# Altium project 触摸扩展板.PrjPcb
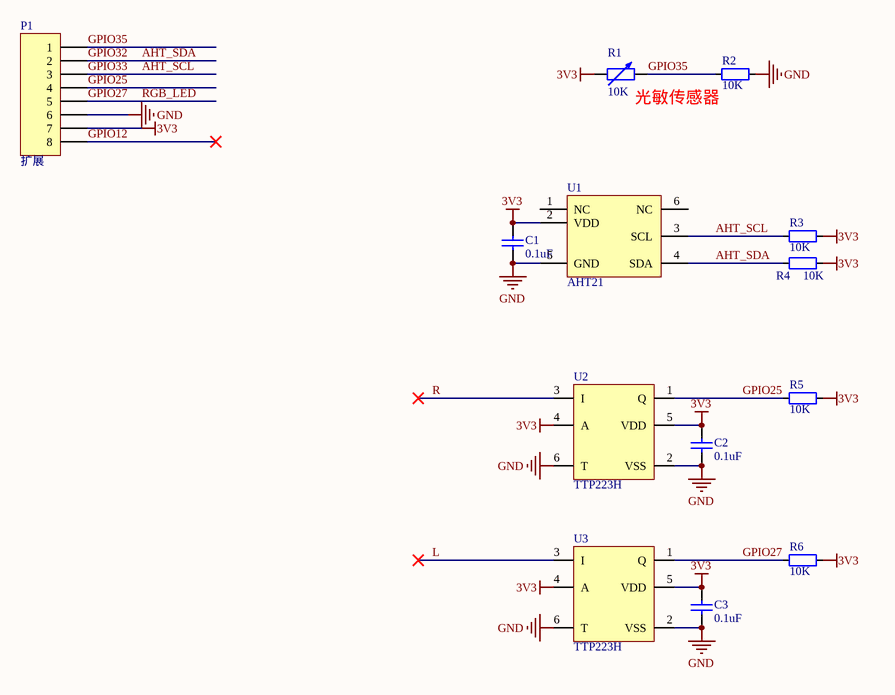
[diagram p0: 触摸扩展板.SchDoc]
1 sheet, 13 parts. Net scope: global (net labels, ports and power ports of the same name join across sheets).
Board file: 触摸扩展板.PcbDoc

## Sheet 触摸扩展板.SchDoc: 触摸扩展板
size A4; DrawnBy: Misaka; Address1: L3, 12a Rodborough Rd; Address2: Frenchs Forest; Address3: NSW; Address4: Australia 2086; Revision: Rev 1.0; SheetNumber: 1; SheetTotal: 1; PageSetup: Record=PageOptions|CenterHorizontal=True|CenterVertical=True|PrintScale=1.00|XCorrection=1.00|YCorrection=1.00|PrintKind=0|BorderSize=5000000|LeftOffset=0|BottomOffset=0|Orientation=2|PaperLength=1000|PaperWidth=1000|Scale=100|PaperSource=7|PrintQuality=-3|MediaType=1|DitherType=10|PrintScaleMode=1|PaperKind=A4|PaperIndex=9

### Parts
C1  0.1uF  [C_0603]
C2  0.1uF  [C_0603]
C3  0.1uF  [C_0603]
P1  扩展  [FPC0.5 2H-WS-8P]
R1  10K  [C_1210]
R2  10K  [R_0603]
R3  10K  [R_0603]
R4  10K  [R_0603]
R5  10K  [R_0603]
R6  10K  [R_0603]
U1  AHT21  [AHT21]
U2  TTP223H  [SOT23-6-Y]
U3  TTP223H  [SOT23-6-Y]

### Nets
3V3: C1.1 C2.1 C3.1 P1.7 R1.1 R3.1 R4.1 R5.1 R6.1 U1.2(VDD) U2.4(A) U2.5(VDD) U3.4(A) U3.5(VDD)
GND: C1.2 C2.2 C3.2 P1.6 R2.1 U1.5(GND) U2.2(VSS) U2.6(T) U3.2(VSS) U3.6(T)
AHT_SCL: P1.3 R3.2 U1.3(SCL)  [also labelled GPIO33]
AHT_SDA: P1.2 R4.2 U1.4(SDA)  [also labelled GPIO32]
GPIO12: P1.8
GPIO25: P1.4 R5.2 U2.1(Q)
GPIO27: P1.5 R6.2 U3.1(Q)  [also labelled RGB_LED]
GPIO35: P1.1 R1.2 R2.2
L: U3.3(I)
R: U2.3(I)

Not connected (* = marked no-connect by the designer): U1 1(NC) 6(NC)

### Notes on the sheet
- (near R1) 光敏传感器
- 电路名称:
- 编号:
- Sch drawn by Misaka
- 版本:
- 作者:
- 时间:

### Library data of the parts
C1-C3 = Cap: Capacitor; Value: 100pF; Published: 8-Jun-2000; LatestRevisionDate: 17-Jul-2002; LatestRevisionNote: Re-released for DXP Platform.; PackageReference: RAD-0.3; Publisher: Altium Limited; PackageDescription: Radial Cap, Thru-Hole; 2 Leads; 0.3 in Pin Spacing
P1 = Header 8: Header, 8-Pin; LatestRevisionDate: 17-Jul-2002; LatestRevisionNote: Re-released for DXP Platform.; Publisher: Altium Limited
R1 = Res Adj2: Variable Resistor; Value: 1K; Set Position: 0.5; Published: 8-Jun-2000; LatestRevisionDate: 17-Jul-2002; LatestRevisionNote: Re-released for DXP Platform.; PackageReference: AXIAL-0.6; Publisher: Altium Limited; PackageDescription: Axial Device, Thru-Hole; 2 Leads; 0.6 in Pin Spacing
R2-R6 = 电阻-0402: Resistor; Value: 22R
U1 = AHT21: 温湿度传感器
U2 U3 = TTP223H: 触摸传感器